# Altium schematic sheet Shift.SchDoc
size Legal portrait; SheetNumber: 4; SheetTotal: 4
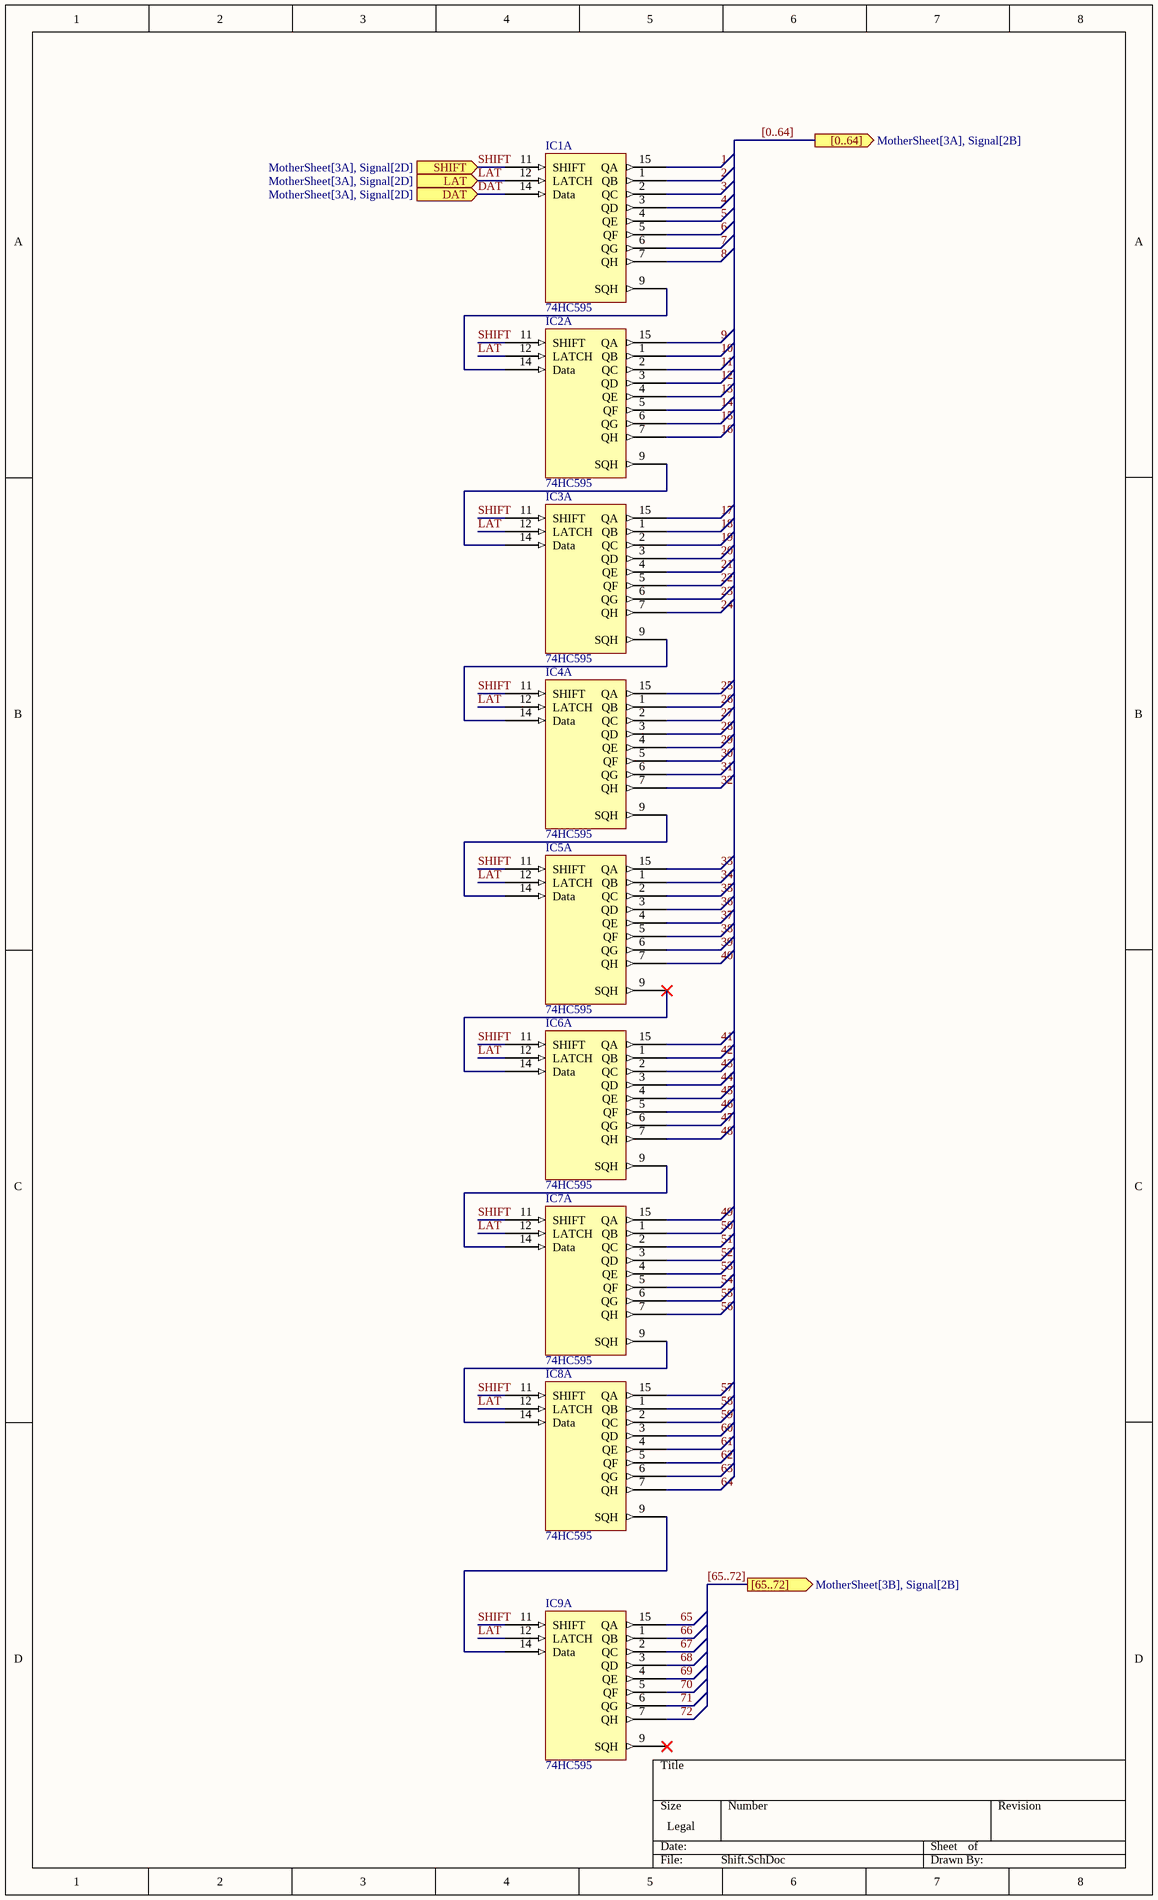
[diagram p0: Shift.SchDoc]

## Parts
IC1  74HC595  [74HC595]  (part A of 2)
IC2  74HC595  [74HC595]  (part A of 2)
IC3  74HC595  [74HC595]  (part A of 2)
IC4  74HC595  [74HC595]  (part A of 2)
IC5  74HC595  [74HC595]  (part A of 2)
IC6  74HC595  [74HC595]  (part A of 2)
IC7  74HC595  [74HC595]  (part A of 2)
IC8  74HC595  [74HC595]  (part A of 2)
IC9  74HC595  [74HC595]  (part A of 2)

## Ports
[0..64] (out, see MotherSheet[3A], Signal[2B]), [65..72] (out, see MotherSheet[3B], Signal[2B]), DAT (in, see MotherSheet[3A], Signal[2D]), LAT (in, see MotherSheet[3A], Signal[2D]), SHIFT (in, see MotherSheet[3A], Signal[2D])

## Nets
1: IC1.15(QA)
2: IC1.1(QB)
3: IC1.2(QC)
4: IC1.3(QD)
5: IC1.4(QE)
6: IC1.5(QF)
7: IC1.6(QG)
8: IC1.7(QH)
9: IC2.15(QA)
10: IC2.1(QB)
11: IC2.2(QC)
12: IC2.3(QD)
13: IC2.4(QE)
14: IC2.5(QF)
15: IC2.6(QG)
16: IC2.7(QH)
17: IC3.15(QA)
18: IC3.1(QB)
19: IC3.2(QC)
20: IC3.3(QD)
21: IC3.4(QE)
22: IC3.5(QF)
23: IC3.6(QG)
24: IC3.7(QH)
25: IC4.15(QA)
26: IC4.1(QB)
27: IC4.2(QC)
28: IC4.3(QD)
29: IC4.4(QE)
30: IC4.5(QF)
31: IC4.6(QG)
32: IC4.7(QH)
33: IC5.15(QA)
34: IC5.1(QB)
35: IC5.2(QC)
36: IC5.3(QD)
37: IC5.4(QE)
38: IC5.5(QF)
39: IC5.6(QG)
40: IC5.7(QH)
41: IC6.15(QA)
42: IC6.1(QB)
43: IC6.2(QC)
44: IC6.3(QD)
45: IC6.4(QE)
46: IC6.5(QF)
47: IC6.6(QG)
48: IC6.7(QH)
49: IC7.15(QA)
50: IC7.1(QB)
51: IC7.2(QC)
52: IC7.3(QD)
53: IC7.4(QE)
54: IC7.5(QF)
55: IC7.6(QG)
56: IC7.7(QH)
57: IC8.15(QA)
58: IC8.1(QB)
59: IC8.2(QC)
60: IC8.3(QD)
61: IC8.4(QE)
62: IC8.5(QF)
63: IC8.6(QG)
64: IC8.7(QH)
65: IC9.15(QA)
66: IC9.1(QB)
67: IC9.2(QC)
68: IC9.3(QD)
69: IC9.4(QE)
70: IC9.5(QF)
71: IC9.6(QG)
72: IC9.7(QH)
DAT: IC1.14(Data) ; port DAT
LAT: IC1.12(LATCH) IC2.12(LATCH) IC3.12(LATCH) IC4.12(LATCH) IC5.12(LATCH) IC6.12(LATCH) IC7.12(LATCH) IC8.12(LATCH) IC9.12(LATCH) ; port LAT
SHIFT: IC1.11(SHIFT) IC2.11(SHIFT) IC3.11(SHIFT) IC4.11(SHIFT) IC5.11(SHIFT) IC6.11(SHIFT) IC7.11(SHIFT) IC8.11(SHIFT) IC9.11(SHIFT) ; port SHIFT
NetIC1_9: IC1.9(SQH) IC2.14(Data)
NetIC2_9: IC2.9(SQH) IC3.14(Data)
NetIC3_9: IC3.9(SQH) IC4.14(Data)
NetIC4_9: IC4.9(SQH) IC5.14(Data)
NetIC5_9: IC5.9(SQH) IC6.14(Data)
NetIC6_9: IC6.9(SQH) IC7.14(Data)
NetIC7_9: IC7.9(SQH) IC8.14(Data)
NetIC8_9: IC8.9(SQH) IC9.14(Data)

Not connected (* = marked no-connect by the designer): IC9 9(SQH)*

## Buses and harness runs
bus [0..64] = port [0..64]
bus [65..72] = port [65..72]

## Library data of the parts
IC1-IC9 = 74HC595: Logic Type: Shift Register; Number of Elements: 1; Number of Bits per Element: 8; Function: Serial to Parallel, Serial; Voltage - Supply: 2V ~ 6V; Output Type: Output Type; Operating Temperature: -55°C ~ 125°C; Package / Case: 16-DIP (0.300", 7.62mm); ComponentLink1Description: Banlinhkien; ComponentLink1URL: https://banlinhkien.com/74hc595-dip16-p6648401.html; ComponentLink2Description: Datasheet; ComponentLink2URL: https://pdf1.alldatasheet.com/datasheet-pdf/view/23121/STMICROELECTRONICS/74HC595.html; ComponentLink3Description: ICDayroi; ComponentLink3URL: https://icdayroi.com/74hc595n